# Altium schematic sheet Power_sources_selector.SchDoc
size A4; SheetNumber: 6; SheetTotal: 10
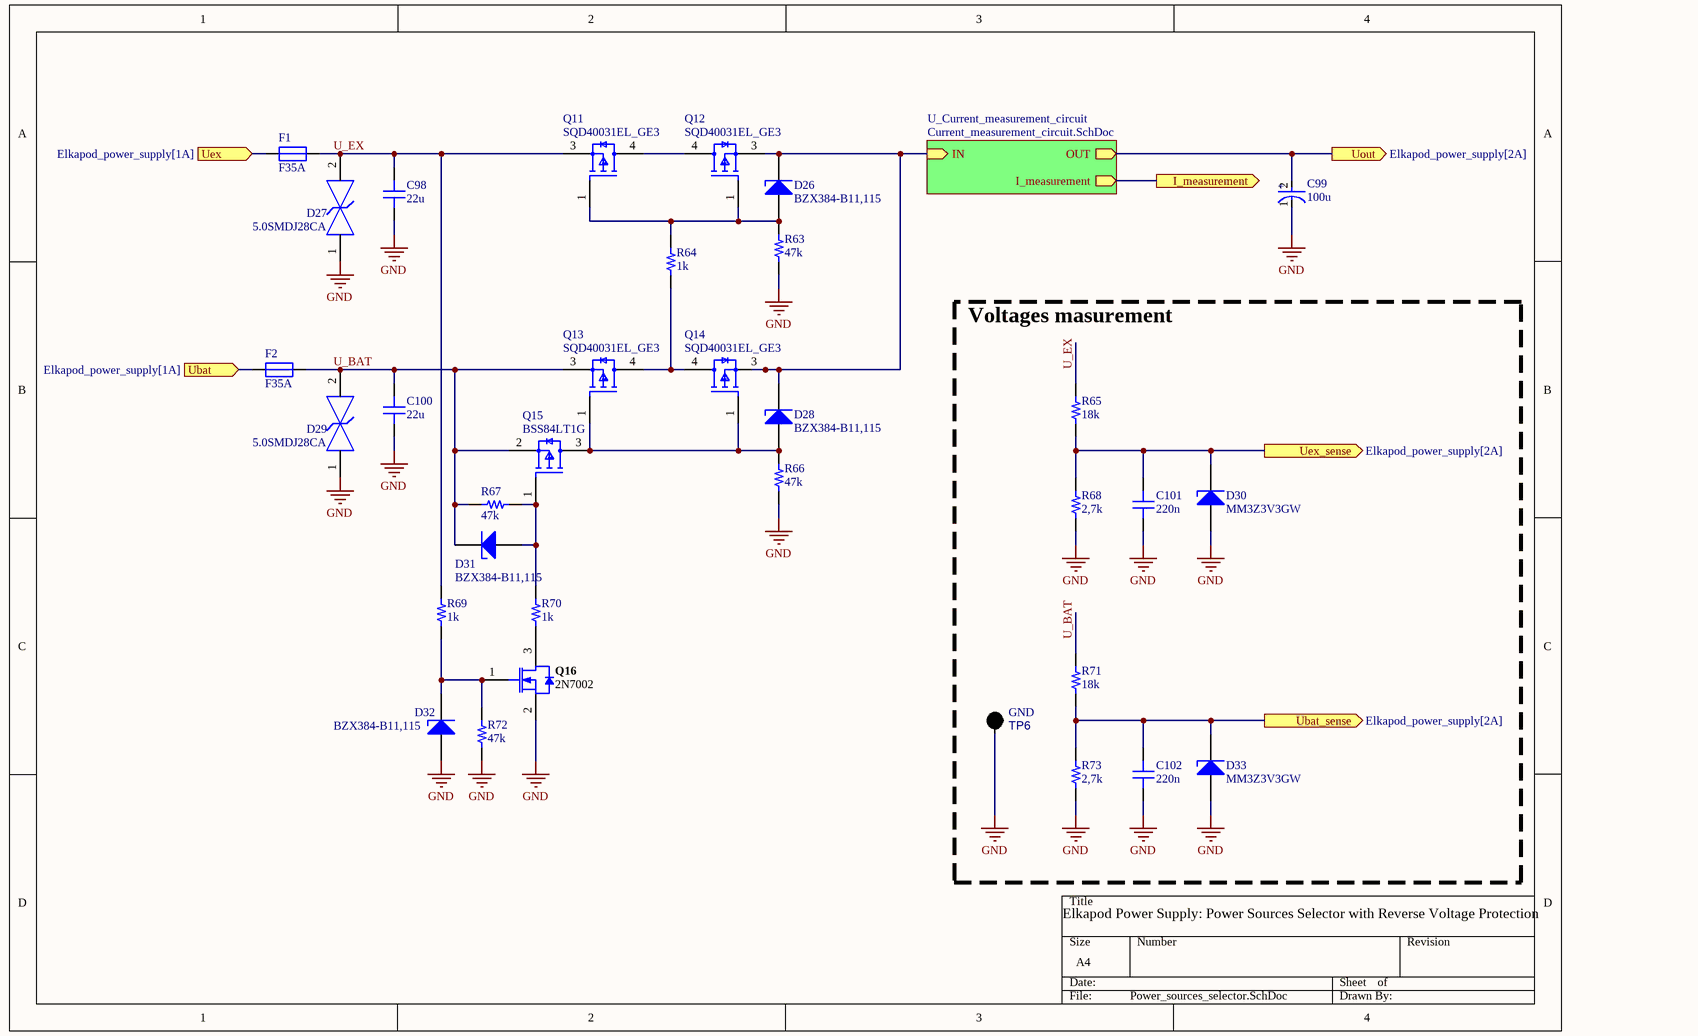
[diagram p0: Power_sources_selector.SchDoc]

## Parts
C98  22u  [CAP 0805_2012]
C99  100u  [FP-FKE-MFG]
C100  22u  [CAP 0805_2012]
C101  220n  [CAP 0603_1608]
C102  220n  [CAP 0603_1608]
D26  BZX384-B11,115  [SOD323]
D27  5.0SMDJ28CA  [FP-5_0SMDJ-CA-MFG]
D28  BZX384-B11,115  [SOD323]
D29  5.0SMDJ28CA  [FP-5_0SMDJ-CA-MFG]
D30  MM3Z3V3GW  [SOD323]
D31  BZX384-B11,115  [SOD323]
D32  BZX384-B11,115  [SOD323]
D33  MM3Z3V3GW  [SOD323]
F1  F35A  [6,3x32_fuse_PCB]
F2  F35A  [6,3x32_fuse_PCB]
Q11  SQD40031EL_GE3  [FP-T13-0592-MFG]
Q12  SQD40031EL_GE3  [FP-T13-0592-MFG]
Q13  SQD40031EL_GE3  [FP-T13-0592-MFG]
Q14  SQD40031EL_GE3  [FP-T13-0592-MFG]
Q15  BSS84LT1G  [FP-318-08-IPC_A]
Q16  2N7002  [INF-PG-SOT23_M]
R63  47k  [RES 0603_1608]
R64  1k  [RES 0603_1608]
R65  18k  [RES 0603_1608]
R66  47k  [RES 0603_1608]
R67  47k  [RES 0603_1608]
R68  2,7k  [RES 0603_1608]
R69  1k  [RES 0603_1608]
R70  1k  [RES 0603_1608]
R71  18k  [RES 0603_1608]
R72  47k  [RES 0603_1608]
R73  2,7k  [RES 0603_1608]
TP6  GND  [Keystone_5006_BLACK]

## Blocks framed on the sheet
Voltages masurement: C101 C102 D30 D33 R65 R68 R71 R73 TP6

## Sub-sheets
U_Current_measurement_circuit = Current_measurement_circuit.SchDoc: I_measurement (out), IN (in), OUT (out)  | Rsense_value: 0,5m

## Ports
I_measurement (out, see Elkapod_power_supply[2A], Current_measurement_circuit[3B]), Ubat (in, see Elkapod_power_supply[1A]), Ubat_sense (out, see Elkapod_power_supply[2A]), Uex (in, see Elkapod_power_supply[1A]), Uex_sense (out, see Elkapod_power_supply[2A]), Uout (out, see Elkapod_power_supply[2A])

## Nets
GND: C98.1 C99.1(C) C100.1 C101.1 C102.1 D27.1 D29.1 D30.1(A) D32.1(A) D33.1(A) Q16.2(SOURCE) R63.1 R66.1 R68.2 R72.1 R73.2 TP6.0
I_measurement: port I_measurement, sheet U_Current_measurement_circuit/I_measurement
U_BAT: C100.2 D29.2 D31.2(K) F2.2 Q13.3(S) Q15.2(S) R67.2 R71.1
U_EX: C98.2 D27.2 F1.2 Q11.3(S) R65.1 R69.2
Ubat: F2.1 ; port Ubat
Ubat_sense: C102.2 D33.2(K) R71.2 R73.1 ; port Ubat_sense
Uex: F1.1 ; port Uex
Uex_sense: C101.2 D30.2(K) R65.2 R68.1 ; port Uex_sense
Uout: C99.2(A) ; port Uout, sheet U_Current_measurement_circuit/OUT
NetD26_1: D26.1(A) Q11.1(G) Q12.1(G) R63.2 R64.2
NetD26_2: D26.2(K) D28.2(K) Q12.3(S) Q14.3(S) ; sheet U_Current_measurement_circuit/IN
NetD28_1: D28.1(A) Q13.1(G) Q14.1(G) Q15.3(D) R66.2
NetD31_1: D31.1(A) Q15.1(G) R67.1 R70.2
NetD32_2: D32.2(K) Q16.1(GATE) R69.1 R72.2
NetQ11_4: Q11.4(D) Q12.4(D)
NetQ13_4: Q13.4(D) Q14.4(D) R64.1
NetQ16_3: Q16.3(DRAIN) R70.1

## Notes on the sheet
- Elkapod Power Supply: Power Sources Selector with Reverse Voltage Protection
- (in symbol CMP-2000-06205-2) +

## Library data of the parts
C98 C100 = VJ0805Y684KXQTW1BC: CAP CER 22UF 25V X7R 0805; manufacturer: Vishay Vitramon; Tolerance: ±10%; Voltage - Rated: 10V; Part Number: VJ0805Y684KXQTW1BC; Value: 22u; Applications: General Purpose; Capacitance: 22u; componentlink1description: Datasheet; componentlink1url: https://www.vishay.com/docs/28548/vjw1bcbascomseries.pdf; componentlink2description: DigiKey Link; componentlink2url: https://www.digikey.com/en/products/detail/vishay-vitramon/VJ0805Y684KXQTW1BC/8313569; Device Package: 0805 (2012 Metric); lastupdated: 09.02.2024 20:13:13; Lifecycle Status: Active; Minimum Order: 1; Mounting Type: Surface Mount, MLCC; Operating Temperature: -55°C ~ 125°C; Package / Case: 0805 (2012 Metric); packaging: TapeAndReel; partid: 57262; price: 0.05; series: VJ W1BC; Size / Dimension: 0.079" L x 0.049" W (2.00mm x 1.25mm); Temperature Coefficient: X7R; Thickness (Max): 0.053" (1.35mm)
C99 = CMP-2000-06205-2: CAP ALUM 100UF 20% 25V SMD; Ripple Current (AC): 300mA; Leakage Current: 3uA; Dielectric Material: Aluminium; Impedance: 260mR; Life (Hours): 2000Hour; Max Operating Temperature: 105°C; Voltage Rating (DC): 25V; Packaging: Tape and Reel; Min Operating Temperature: -55°C; Capacitance: 100uF; Ripple Current: 300mA; Mount: Surface Mount; Lead Free: Lead Free; Construction: Cylindrical; Voltage Rating: 25V; RoHS Compliant: Yes; Case/Package: Radial; Height: 6.2mm; Tolerance: 20%; Diameter: 8mm; Termination: SMD/SMT; Package Quantity: 1; Width: 8.3mm; REACH SVHC: No SVHC; Series: FK; Number of Pins: 2; Voltage: 25V; Radiation Hardening: No; Height - Seated (Max): 0.244inch; Length: 6.2mm; ESR (Equivalent Series Resistance): 260mR
C101 C102 = C0603C272F3GAC7867: CAP CER 220nF 25V X5R 0603; manufacturer: KEMET; Temperature Coefficient: C0G, NP0; Tolerance: ±1%; Part Number: C0603C272F3GAC7867; Value: 220n; Applications: General Purpose; Capacitance: 220n; componentlink1description: Datasheet; componentlink1url: https://api.kemet.com/component-edge/download/datasheet/C0603C272F3GACTU.pdf; componentlink2description: DigiKey Link; componentlink2url: https://www.digikey.com/en/products/detail/kemet/C0603C272F3GAC7867/2200413; Device Package: 0603 (1608 Metric); Features: Low ESL; lastupdated: 09.02.2024 20:10:30; Lifecycle Status: Active; Minimum Order: 1; Mounting Type: Surface Mount, MLCC; Operating Temperature: -55°C ~ 125°C; Package / Case: 0603 (1608 Metric); packaging: TapeAndReel; partid: 2138; Part Status: Active; price: 0.40; series: SMD Comm C0G; Size / Dimension: 0.063" L x 0.031" W (1.60mm x 0.80mm); Thickness (Max): 0.034" (0.87mm); Voltage - Rated: 25V
D26 D28 D31 D32 = Zener_Diode_SOD323: 11V, 0,3W Zener diode
D27 D29 = CMP-08607-000055-1: TVS DIODE 28V 45.4V DO214AB; Manufacturer: Littelfuse Inc; Breakdown Voltage: 31.1V; Peak Pulse Current: 110A; Number Of Channels: 1; Direction: Bidirectional; Max Junction Temp: +150°C; Peak Pulse Power: 5000W; Device Class L1: Circuit Protection; Manufacturer Part Number: 5.0SMDJ28CA; Package: 5.0SMDJ-CA; Mouser Description: 5.0SMDJ Series 31.1 V 5 kW Surface Mount Bi-Directional TVS Diode - DO-214AB; Category: Diode; Digikey Description: TVS DIODE 28V 45.4V DO214AB; Temperature Range Low: -65°C; Device Class L2: TVS Diodes; Temperature: -65°C to +150°C; ComponentLink2Description: Datasheet; RoHS: TRUE; Temperature Range High: +150°C; Automotive: No; Lead Free: Yes; Reverse Standoff Voltage: 28V; Device Class L3: unset; Height: 2.62mm; Octopart: https://octopart.com/5.0smdj28ca-littelfuse-12584638; ComponentLink2URL: https://www.littelfuse.com/~/media/electronics/datasheets/tvs_diodes/littelfuse_tvs_diode_5_0smdj_datasheet.pdf.pdf; Clamping Voltage: 45.4V
D30 D33 = Zener_Diode_SOD323: 3,3V, 0,3W Zener diode; SOD323
F1 F2 = 6,3x32_FUSE
Q11-Q14 = CMP-00030-91482453-1: SQD40031EL_GE3 Transistor MOSFET P-CH 30V 100A 3-Pin TO-252; Max Junction Temperature (Tj): 175°C; Continuous Drain Current (ID): -100A; Drain to Source Resistance: 2.63mΩ; Turn-On Delay Time: 16ns; Drain to Source Voltage (Vdss): -30V; Turn-Off Delay Time: 126ns; Power Dissipation: 136W; Gate to Source Voltage (Vgs): 20V; Number of Channels: 1; RoHS: Non-Compliant; NexarPartId: 91482453; Max Operating Temperature: 175°C; Drain to Source Breakdown Voltage: -30V; Height: 2.507mm; Min Operating Temperature: -55°C
Q15 = CMP-1058-00762-2: MOSFET P-CH 50V 130MA SOT-23; Max Power Dissipation: 225mW; On-State Resistance: 10R; Nominal Vgs: 2V; Gate to Source Voltage (Vgs): 20V; Rise Time: 1ns; Turn-Off Delay Time: 16ns; Voltage Rating (DC): -50V; Turn-On Delay Time: 3.6ns; Number of Elements: 1; Current Rating: -130mA; Input Capacitance: 30pF; Threshold Voltage: -2V; Element Configuration: Single; Drain to Source Breakdown Voltage: 50V; Continuous Drain Current (ID): 130mA; Length: 0.119inch; Drain to Source Voltage (Vdss): 50V; Min Operating Temperature: -55°C; Contact Plating: Tin; Lead Free: Lead Free; Width: 0.055inch; Case/Package: SOT-23-3; Max Operating Temperature: 150°C; Halogen Free: Halogen Free; Radiation Hardening: No; Drain to Source Resistance: 10R; REACH SVHC: No SVHC; Power Dissipation: 225mW; Number of Pins: 3; Package Quantity: 1; Packaging: Tape and Reel; Fall Time: 1ns; Rds On Max: 10R; Height: 0.04inch
Q16 = CMP-1149-00026-1: N-Channel OptiMOS Small-Signal-Transistor, 60 V VDS, 0.3 A ID, -55 to 150 degC, PG-SOT23, Reel, Green; Manufacturer: Infineon; RDS (on) (max) (@4.5V): 4,000 mOhm; VDS (max): 60 V; IDpuls (max): 1.2Â A; QG: 0.4Â nC; RDS (on) (max): 3,000 mOhm; RthJA (max): 250 K/W; ID (max): 0.3Â A; VGS(th) (max): 2.5Â V; VGS(th) (min): 1.5Â V; Green: TRUE; Ptot (max): 0.5Â W; PackageDescription: 3-Pin Small Outline Transistor Package, 2.9 x 1.3 mm Body, 0.95 mm Pitch; Halogen-free: TRUE; ComponentLink2Description: Datasheet; ComponentLink1URL: http://www.infineon.com/; Packing: Reel; DatasheetVersion: Rev. 2.4; PartNumber: 2N7002; PackageReference: PG-SOT23; PackageVersion: Apr-08; ComponentLink3URL: http://www.infineon.com/dgdl/SOT23-Package_Overview.pdf?folderId=db3a30431936bc4b0119532290053c66&fileId=db3a30431936bc4b0119533468123c85; ComponentLink1Description: Manufacturer URL; Mounting Technology: Surface Mount; ComponentLink3Description: Package Specification; ComponentLink2URL: http://www.infineon.com/dgdl/2N7002_Rev2.4.pdf?folderId=db3a3043156fd573011622e10b5c1f67&fileId=db3a304319bc939a0119c2a9461e79e6
R63 R66 R67 R72 = RNCS0603BKE10K0: RES 47K OHM 1% 0,1W 0603; Manufacturer: Stackpole Electronics Inc; Power (Watts): 0.063W, 1/16W; Temperature Coefficient: ±25ppm/°C; Tolerance: ±0.1%; Part Number: RNCS0603BKE10K0; Value: 47k; Composition: Thin Film; Device Package: 0603 (1608 Metric); Features: Anti-Corrosive, Automotive AEC-Q200, Moisture Resistant; Height - Seated (Max): 0.022" (0.55mm); LastUpdated: 09.02.2024 20:43:37; Lifecycle Status: Active; Minimum Order: 1; Number of Terminations: 2; Operating Temperature: -55°C ~ 155°C; Package / Case: 0603 (1608 Metric); Packaging: TapeAndReel; PartId: 4838; Part Status: Active; Price: 0.06; Ratings: AEC-Q200; Resistance: 47k; Series: RNCS; Size / Dimension: 0.061" L x 0.031" W (1.55mm x 0.80mm); Supplier Device Package: 0603
R64 R69 R70 = RNCS0603BKE10K0: RES 1K OHM 1% 0,1W 0603; Manufacturer: Stackpole Electronics Inc; Power (Watts): 0.063W, 1/16W; Temperature Coefficient: ±25ppm/°C; Tolerance: ±0.1%; Part Number: RNCS0603BKE10K0; Value: 1k; Composition: Thin Film; Device Package: 0603 (1608 Metric); Features: Anti-Corrosive, Automotive AEC-Q200, Moisture Resistant; Height - Seated (Max): 0.022" (0.55mm); LastUpdated: 09.02.2024 20:43:37; Lifecycle Status: Active; Minimum Order: 1; Number of Terminations: 2; Operating Temperature: -55°C ~ 155°C; Package / Case: 0603 (1608 Metric); Packaging: TapeAndReel; PartId: 4838; Part Status: Active; Price: 0.06; Ratings: AEC-Q200; Resistance: 1k; Series: RNCS; Size / Dimension: 0.061" L x 0.031" W (1.55mm x 0.80mm); Supplier Device Package: 0603
R65 R71 = RNCS0603BKE10K0: RES 18K OHM 1% 0,1W 0603; Manufacturer: Stackpole Electronics Inc; Power (Watts): 0.063W, 1/16W; Temperature Coefficient: ±25ppm/°C; Tolerance: ±0.1%; Part Number: RNCS0603BKE10K0; Value: 18k; Composition: Thin Film; Device Package: 0603 (1608 Metric); Features: Anti-Corrosive, Automotive AEC-Q200, Moisture Resistant; Height - Seated (Max): 0.022" (0.55mm); LastUpdated: 09.02.2024 20:43:37; Lifecycle Status: Active; Minimum Order: 1; Number of Terminations: 2; Operating Temperature: -55°C ~ 155°C; Package / Case: 0603 (1608 Metric); Packaging: TapeAndReel; PartId: 4838; Part Status: Active; Price: 0.06; Ratings: AEC-Q200; Resistance: 18k; Series: RNCS; Size / Dimension: 0.061" L x 0.031" W (1.55mm x 0.80mm); Supplier Device Package: 0603
R68 R73 = RNCS0603BKE10K0: RES 2,7K OHM 1% 0,1W 0603; Manufacturer: Stackpole Electronics Inc; Power (Watts): 0.063W, 1/16W; Temperature Coefficient: ±25ppm/°C; Tolerance: ±0.1%; Part Number: RNCS0603BKE10K0; Value: 2,7k; Composition: Thin Film; Device Package: 0603 (1608 Metric); Features: Anti-Corrosive, Automotive AEC-Q200, Moisture Resistant; Height - Seated (Max): 0.022" (0.55mm); LastUpdated: 09.02.2024 20:43:37; Lifecycle Status: Active; Minimum Order: 1; Number of Terminations: 2; Operating Temperature: -55°C ~ 155°C; Package / Case: 0603 (1608 Metric); Packaging: TapeAndReel; PartId: 4838; Part Status: Active; Price: 0.06; Ratings: AEC-Q200; Resistance: 2,7k; Series: RNCS; Size / Dimension: 0.061" L x 0.031" W (1.55mm x 0.80mm); Supplier Device Package: 0603
TP6 = Keystone 5006 Test Point: Keystone 5006 Test Point (BLACK)